# Altium schematic sheet DAC.SchDoc: DAC
size B; Date: 2015-01-30; Author: Marcin Czajkowski; Organization: Marcin Czajkowski; Address1: SN:3547684; Address2: ESE-Year2; Address3: Conestoga College; Address4: Project IV; DocumentNumber: 1; Revision: A; SheetNumber: 12; SheetTotal: 14
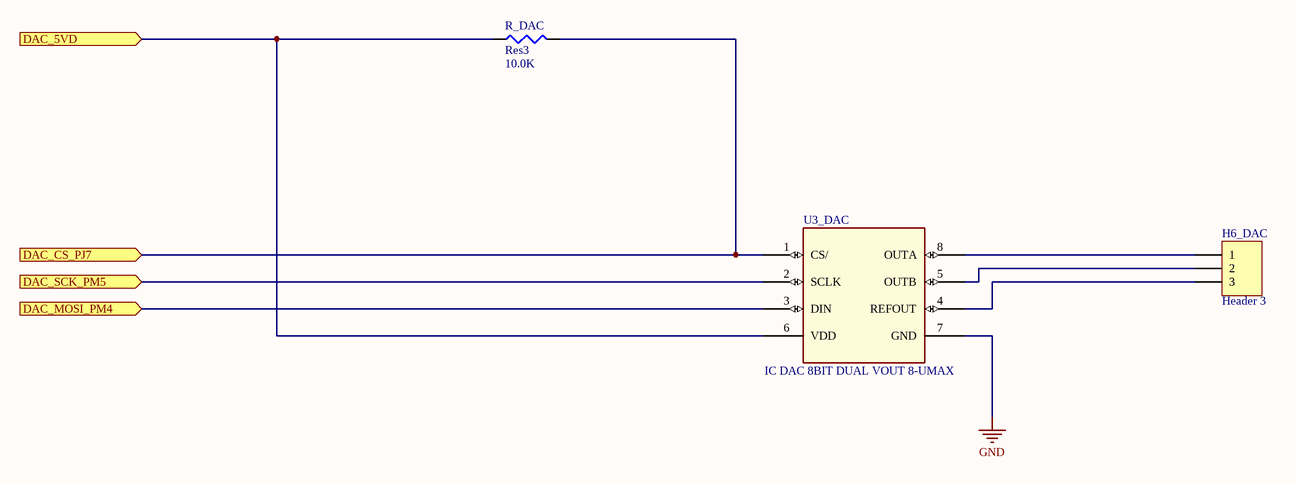
[diagram p0: DAC.SchDoc]

## Parts
H6_DAC  Header 3  [HDR1X3]
R_DAC  Res3  value 10.0K  [RESC2112X05M]
U3_DAC  IC DAC 8BIT DUAL VOUT 8-UMAX  [TSOP65P490X110-8M]

## Ports
DAC_5VD (in), DAC_CS_PJ7 (in), DAC_MOSI_PM4 (in), DAC_SCK_PM5 (in)

## Nets
GND: U3_DAC.7(GND)
DAC_5VD: R_DAC.1 U3_DAC.6(VDD) ; port DAC_5VD
DAC_CS_PJ7: R_DAC.2 U3_DAC.1(CS/) ; port DAC_CS_PJ7
DAC_MOSI_PM4: U3_DAC.3(DIN) ; port DAC_MOSI_PM4
DAC_SCK_PM5: U3_DAC.2(SCLK) ; port DAC_SCK_PM5
NetH6_DAC_1: H6_DAC.1 U3_DAC.8(OUTA)
NetH6_DAC_2: H6_DAC.2 U3_DAC.5(OUTB)
NetH6_DAC_3: H6_DAC.3 U3_DAC.4(REFOUT)

## Notes on the sheet
- ESE
- is the sole property of ESE. Any reproduction
- The Information Contained in this drawing
- Schematic P/N and Name
- Sheet Name
- 299 Doon Valley Drive
- Kitchener, ON N2G 4M4
- Canada
- Approved
- in part or in whole without the written
- permission of ESE is strictly prohibited.
- APPROVALS
- DATE
- Size
- Scale
- B
- NTS
- Bare PCB P/N
- Date
- Sheet
- Rev.
- Checked
- Engineer
- of

## Library data of the parts
H6_DAC = Header 3: Header, 3-Pin; LatestRevisionDate: 17-Jul-2002; LatestRevisionNote: Re-released for DXP Platform.; Publisher: Altium Limited
R_DAC = Resistor_10.0K: RES SMD 10.0K OHM 1% 1/8W 0805; MPN: CRCW080510K0FKEA; PN: 541-10.0KCCT-ND; Name: Resistor_10.0K; URL: http://www.digikey.ca/product-detail/en/CRCW080510K0FKEA/541-10.0KCCT-ND
U3_DAC = Max5513-dac: MPN: MAX5513EUA+; PN: MAX5513EUA+-ND; URL: http://www.digikey.ca/product-detail/en/MAX5513EUA%2B/MAX5513EUA%2B-ND